# EAGLE design OR_Gate_Using_Transistor (EAGLE 9.6.2)
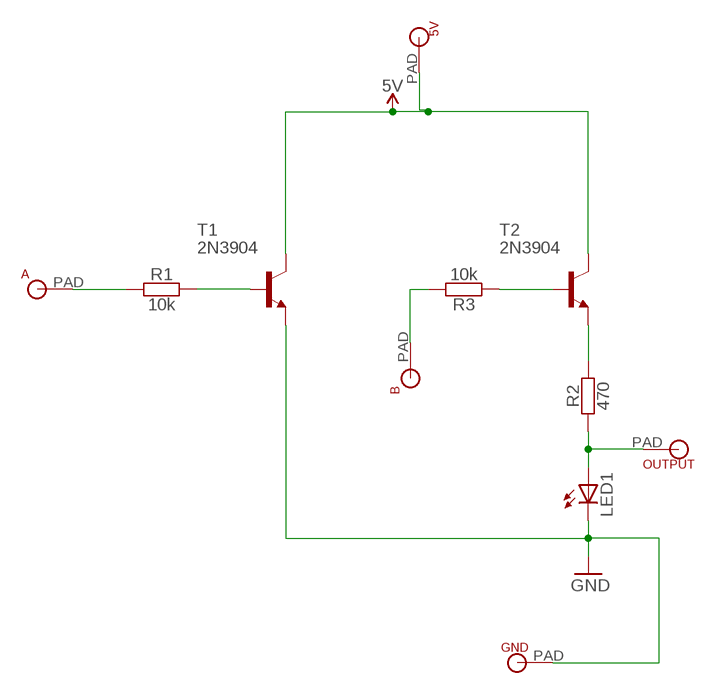
[diagram p0: schematic, sheet 1]

## Parts
5V  MICROBIT_PAD  [MICROBIT_PAD]
A  MICROBIT_PAD  [MICROBIT_PAD]
B  MICROBIT_PAD  [MICROBIT_PAD]
GND  MICROBIT_PAD  [MICROBIT_PAD]
LED1  LED3MM  [LED3MM]
OUTPUT  MICROBIT_PAD  [MICROBIT_PAD]
R1  10k  RESISTOR-07  [R0207/7]
R2  470  RESISTOR-07  [R0207/7]
R3  10k  RESISTOR-07  [R0207/7]
T1  2N3904  [TO92]
T2  2N3904  [TO92]

## Nets
5V: 5V.PAD T1.1(C) T2.1(C)
GND: GND.PAD LED1.K(C) T1.3(E)
N$2: B.PAD R3.2
N$3: R3.1 T2.2(B)
N$4: R1.2 T1.2(B)
N$5: A.PAD R1.1
N$6: LED1.A OUTPUT.PAD R2.1
N$7: R2.2 T2.3(E)

## Library data of the parts
5V A B GND OUTPUT = microbit:MICROBIT_PAD
LED1 = adafruit:LED: LED OSRAM: - CHIPLED LG R971, LG N971, LY N971, LG Q971, LY Q971, LO R971, LY R971 LH N974, LH R974 LS Q976, LO Q976, LY Q976 LO Q996 - Hyper CHIPLED LW Q18S LB Q993, LB Q99A, LB R99A - SideLED LS A670, LO A670, LY A670, LG A670, LP A670 LB A673, LV A673, LT A673, LW A673 LH A674 LY A675 LS A676, LA A676, LO A676, LY A676, LW A676 LS A679, LY A679, LG A679 - Hyper Micro SIDELED® LS Y876, LA Y876, LO Y876, LY Y876 LT Y87S - SmartLED LW L88C, LW L88S LB L89C, LB L89S, LG L890 LS L89K, LO L89K, LY L89K LS L896, LA L896, LO L896, LY L896 - TOPLED LS T670, LO T670, LY T670, LG T670, LP T670 LSG T670, LSP T670, LSY T670, LOP T670, LYG T670 LG T671, LOG T671, LSG T671 LB T673, LV T673, LT T673, LW T673 LH T674 LS T676, LA T676, LO T676, LY T676, LB T676, LH T676, LSB T676, LW T676 LB T67C, LV T67C, LT T67C, LS T67K, LO T67K, LY T67K, LW E67C LS E67B, LA E67B, LO E67B, LY E67B, LB E67C, LV E67C, LT E67C LW T67C LS T679, LY T679, LG T679 LS T770, LO T770, LY T770, LG T770, LP T770 LB T773, LV T773, LT T773, LW T773 LH T774 LS E675, LA E675, LY E675, LS T675 LS T776, LA T776, LO T776, LY T776, LB T776 LHGB T686 LT T68C, LB T68C - Hyper Mini TOPLED® LB M676 - Mini TOPLED Santana® LG M470 LS M47K, LO M47K, LY M47K Source: http://www.osram.convergy.de/
R1-R3 = we-rcl:RESISTOR: Resistor all kinds in 0402 and 0603
T1 T2 = transistor:2N3904: NPN TRANSISTOR

## Board
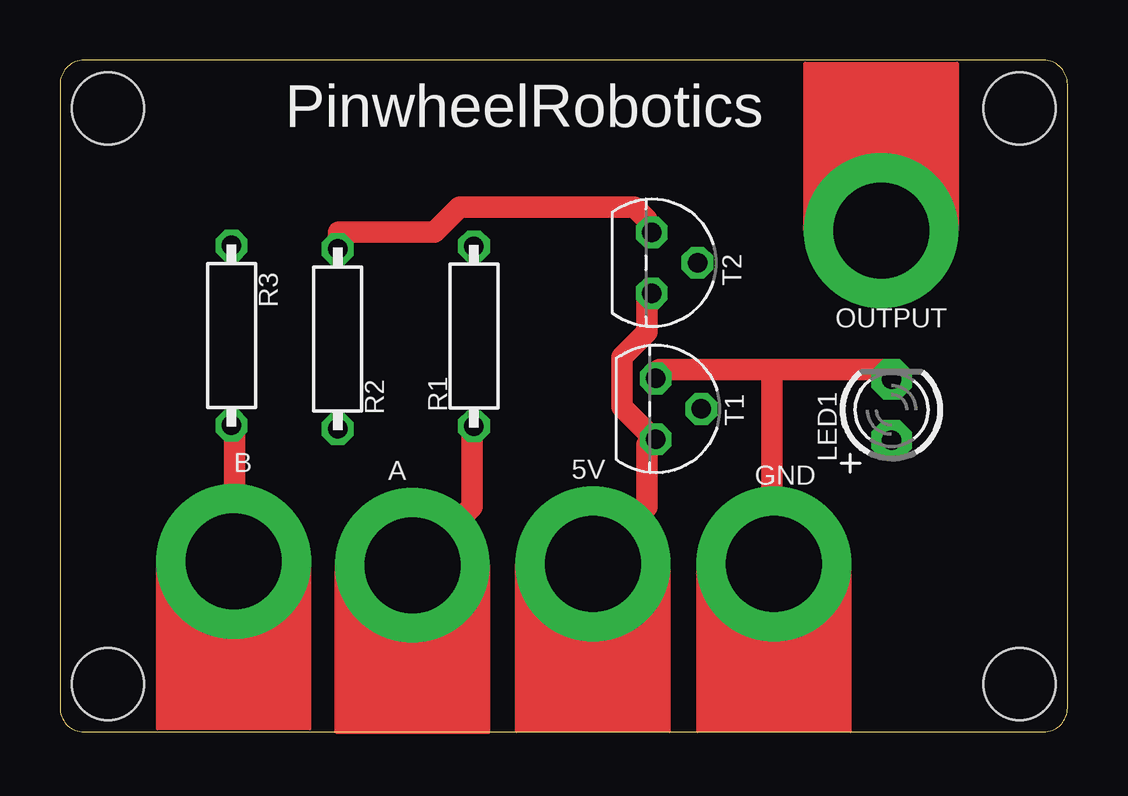
[diagram p1: board, top side]
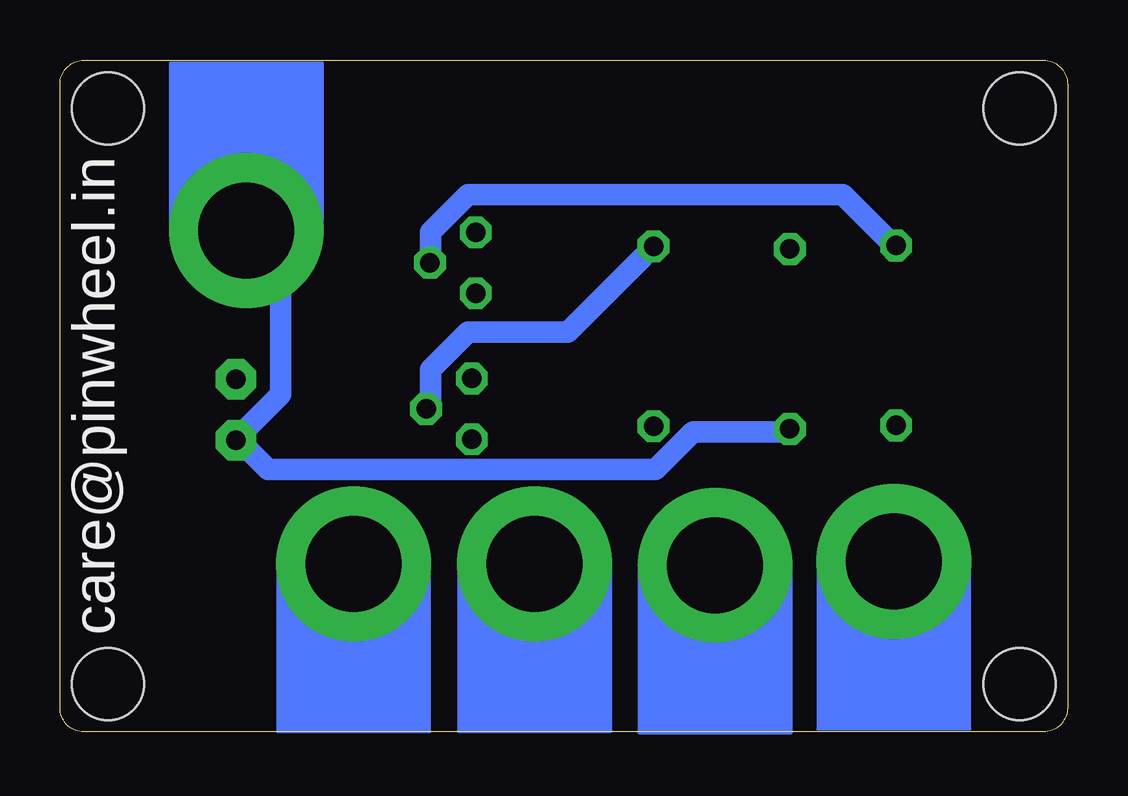
[diagram p2: board, bottom side, seen from below]

Size 42 x 28 mm. Coordinates in mm from the lower left corner, seen from the top.
Outline: 0,27 0,1 arc90 1,0 41,0 arc90 42,1 42,27 arc90 41,28 1,28 arc90 0,27
Copper layers (1*16): Top 0.035mm / dielectric 1.5mm / Bottom 0.035mm
Design rules "default *": minimum track width 35mil, minimum drill 0.35mm, track to track 6mil, track to pad 6mil, pad to pad 6mil, via to via 6mil, smd to smd 6mil, copper to edge 40mil, drill to drill 6mil, minimum pad ring 10mil, minimum via ring 8mil, stop-mask expansion 4mil, vias tented up to drill 0mil, thermal gap 10mil
Holes 3 mm at 2,2 2,26 40,26 40,2

### Footprints (pad centres in the part's own frame; a part is rotated, then mirrored left to right if it is on the bottom)
MICROBIT_PAD = drill 4 pad 6.452: PAD 0,0
LED3MM = drill 0.813 pad 1.676 octagon: A -1.27,0; K 1.27,0
R0207/7 = drill 0.813 octagon: 1 -3.75,0; 2 3.75,0
TO92 = drill 0.813 octagon: 1 1.27,0; 2 0,1.905; 3 -1.27,0

### Placement (x,y rotation side)
5V  22.21,7 0 top
A  14.69,6.95 0 top
B  7.24,7.11 0 top
GND  29.76,7 0 top
LED1  34.67,13.43 90 top
OUTPUT  34.23,20.9 180 top
R1  17.26,16.5 90 top
R2  11.57,16.38 90 top
R3  7.15,16.53 270 top
T1  24.83,13.47 270 top
T2  24.67,19.56 270 top

### Tracks (layer width: path | path; a pad name or v marks a point on that pad's centre or on a via)
5V
  Top 0.889: 5V.PAD 22.39,7.29 24.47,9.37 24.47,11.98 T1.1 24.47,12.5 23.43,13.54 23.43,15.62 24.47,16.66 24.47,18.22 T2.1
GND
  Top 0.889: 29.68,15.1 34.37,15.1 LED1.K | 29.68,15.1 24.99,15.1 T1.3 | 29.68,15.1 29.68,7.29 GND.PAD
N$2
  Top 0.889: R3.2 7.29,12.5 7.29,7.29 B.PAD
N$3
  Bottom 0.889: T2.2 26.56,19.79 26.56,20.83 24.99,22.39 9.37,22.39 7.29,20.31 R3.1
N$4
  Bottom 0.889: T1.2 26.56,13.54 26.56,15.1 24.99,16.66 20.83,16.66 17.7,19.79 R1.2
N$5
  Top 0.889: R1.1 17.18,12.5 17.18,9.37 15.1,7.29 A.PAD
N$6
  Bottom 0.889: R2.1 11.58,12.5 15.62,12.5 17.18,10.94 33.33,10.94 34.37,11.98 LED1.A 34.37,12.5 32.8,14.06 32.8,19.79 33.85,20.83 OUTPUT.PAD
N$7
  Top 0.889: R2.2 11.61,20.83 15.62,20.83 16.66,21.87 23.95,21.87 24.47,21.35 T2.3

### Text on the board
tPlace: PinwheelRobotics
bPlace: care@pinwheel.in